# EAGLE schematic lt3477-buck-boost-flashlight-driver-17mm-mk-1.0 (EAGLE 9.2.0)
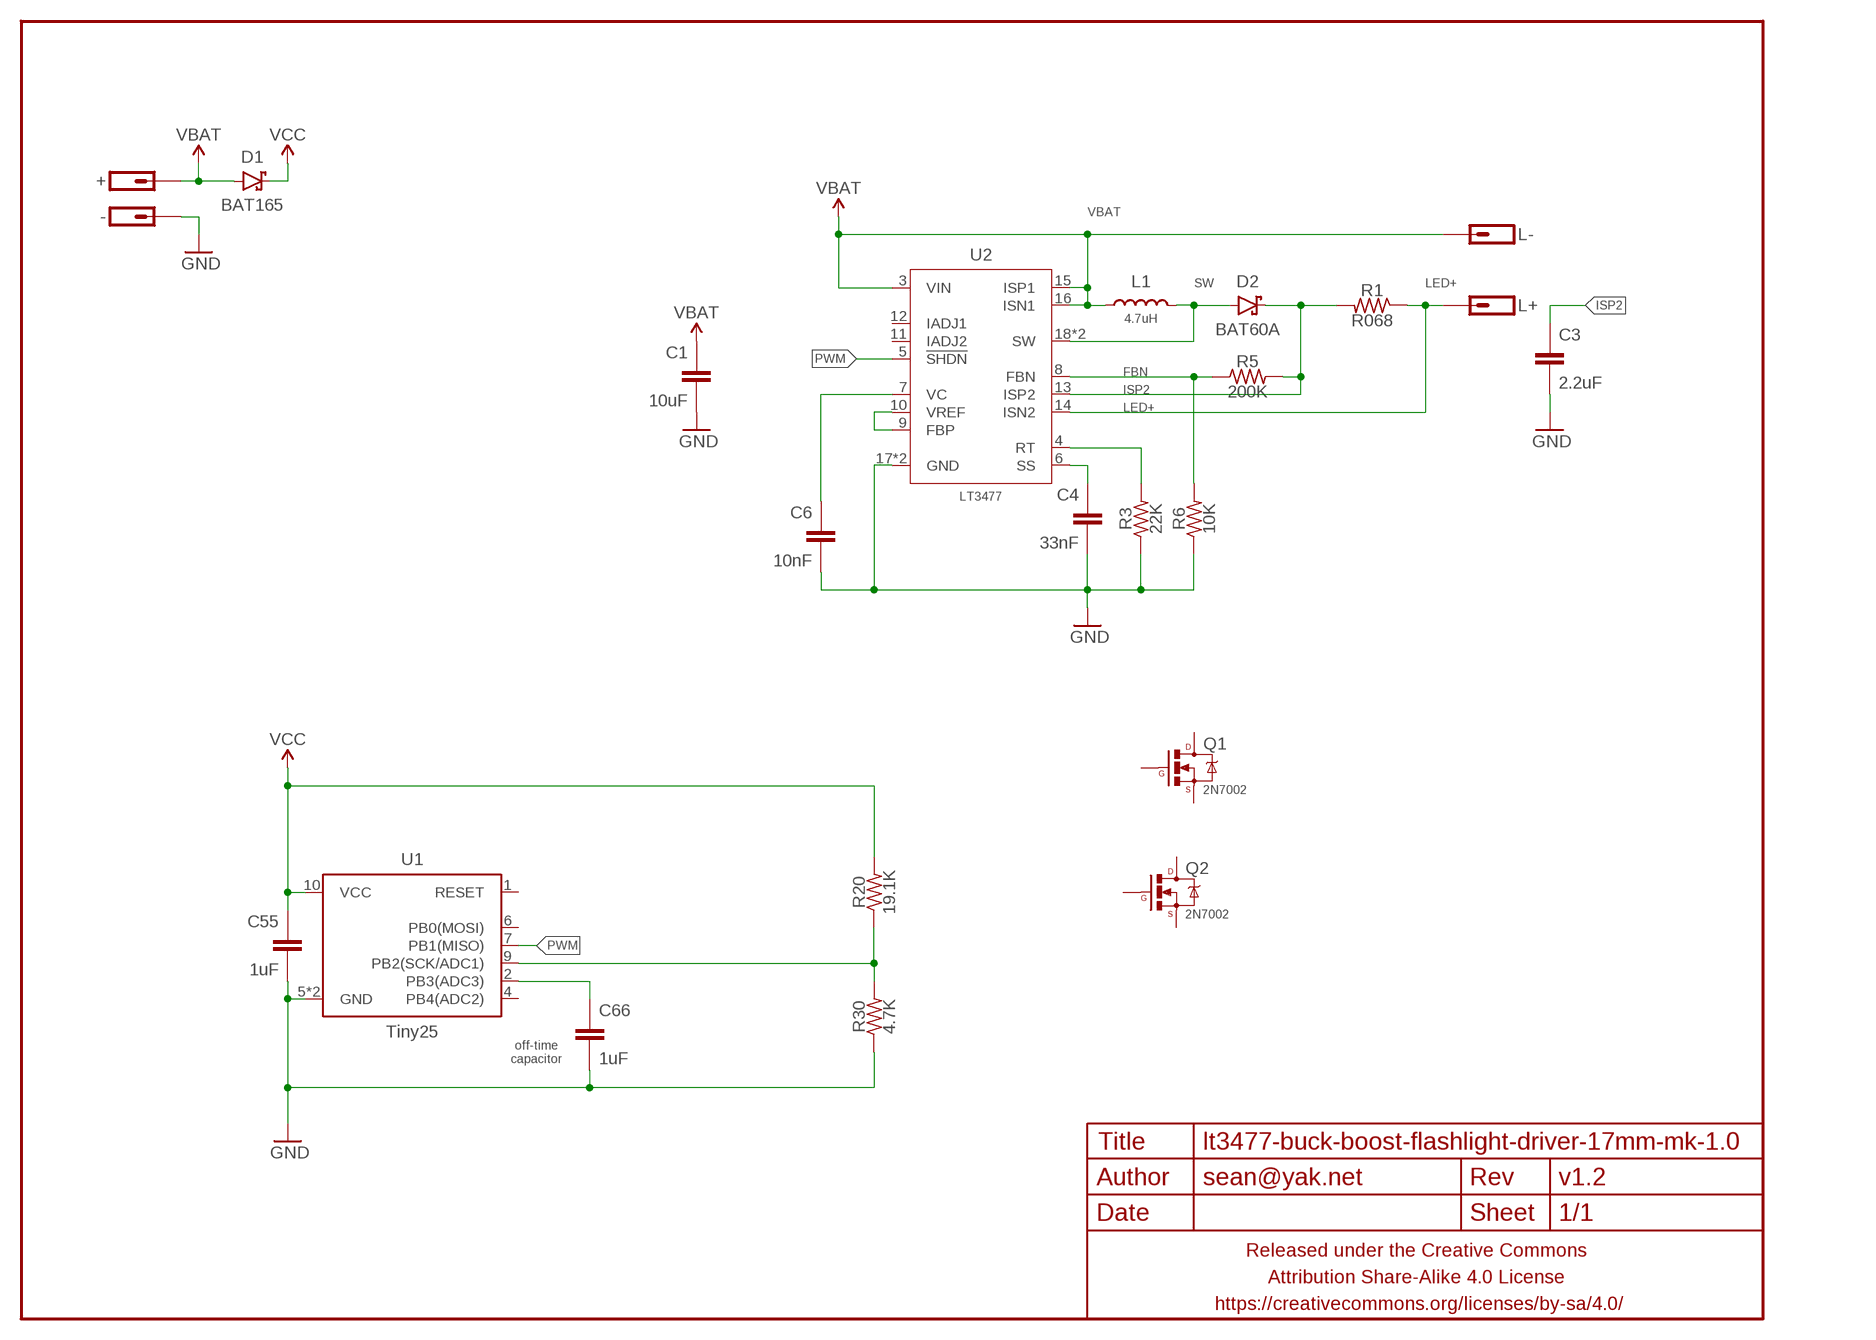
[diagram p0: schematic, sheet 1]

## Parts
+  M01PTH-1MM-CIR-NS  [1X01-1MM-CIR-NS]
-  M01NOT-A-VIA-NOPE  [1X01_NOSILK_NOSTOP]
C1  10uF  CAPACITOR-CERAMICC0603-TIGHTER  [C0603-TIGHTER]
C3  2.2uF  CAPACITOR-CERAMICC0603-TIGHTER  [C0603-TIGHTER]
C4  33nF  CAPACITOR-CERAMICC0402  [C0402]
C6  10nF  CAPACITOR-CERAMICC0402  [C0402]
C55  1uF  CAPACITOR-CERAMICC0603-TIGHTER  [C0603-TIGHTER]
C66  1uF  CAPACITOR-CERAMICC0402  [C0402]
D1  BAT165  DIODE-SCHOTTKYSOD323  [SOD323-SCHOTTKY]
D2  BAT60A  DIODE-SCHOTTKYSOD323  [SOD323-SCHOTTKY]
FRAME1  FRAME-LETTERNO_PACKAGE  [DUMMY]
L1  4.7uH  INDUCTORXAL40X0  [XAL40X0]
L+  M01PTH-1MM-CIR-NS  [1X01-1MM-CIR-NS]
L-  M01PTH-1MM-CIR-NS  [1X01-1MM-CIR-NS]
Q1  2N7002  MOSFET-NCHANNELIRLML2502  [SOT23]
Q2  2N7002  MOSFET-NCHANNELIRLML2502  [SOT23]
R1  R068  RESISTORR0805-TIGHTER  [R0805-TIGHTER]
R3  22K  RESISTORR0402  [R0402]
R5  200K  RESISTORR0402  [R0402]
R6  10K  RESISTORR0402  [R0402]
R20  19.1K  RESISTORR0603-TIGHTER  [R0603-TIGHTER]
R30  4.7K  RESISTORR0603-TIGHTER  [R0603-TIGHTER]
U1  Tiny25  ATTINY1310M1  [QFN10(2X5)]
U2  LT3477  [QFN20-LTC]

## Nets
FBN: R5.1 R6.2 U2.8(FBN)
GND: -.P$1 C1.2 C3.2 C4.2 C6.2 C55.2 C66.2 R3.1 R6.1 R30.1 U1.5(GND) U1.PAD(GND) U2.17(GND) U2.PAD(GND)
ISP2: C3.1 D2.C R1.2 R5.2 U2.13(ISP2)
LED+: L+.1 R1.1 U2.14(ISN2)
N$1: R3.2 U2.4(RT)
N$2: C6.1 U2.7(VC)
N$3: R20.1 R30.2 U1.9(PB2(SCK/ADC1))
N$4: C4.1 U2.6(SS)
N$5: C66.1 U1.2(PB3(ADC3))
N$9: U2.9(FBP) U2.10(VREF)
PWM: U1.7(PB1(MISO)) U2.5(!SHDN)
SW: D2.A L1.P$2 U2.18(SW) U2.19(SW)
VBAT: +.1 C1.1 D1.A L1.P$1 L-.1 U2.3(VIN) U2.15(ISP1) U2.16(ISN1)
VCC: C55.1 D1.C R20.2 U1.10(VCC)
Unconnected: Q1.1(G) Q1.2(S) Q1.3(D) Q2.1(G) Q2.2(S) Q2.3(D) U1.1(RESET) U1.4(PB4(ADC2)) U1.6(PB0(MOSI)) U2.11(IADJ2) U2.12(IADJ1)

## Notes on the sheet
- off-time
  capacitor

## Library data of the parts
+ - L+ L- = a_parts:M01: Header 1 Standard 1-pin 0.1" header. Use with straight break away headers (SKU : PRT-00116), right angle break away headers (PRT-00553), swiss pins (PRT-00743), machine pins (PRT-00117), and female headers (PRT-00115).
C1 C3 C4 C6 C55 C66 = a_parts:CAPACITOR-CERAMIC: CAPACITOR, European symbol
D1 D2 = a_parts:DIODE-SCHOTTKY: Schottky diodes in SFE's production catalog BAT20J 1A 23V 0.62Vf RB751 120mA 40V 0.37Vf PMEG4005EJ 0.5A 40V 0.42Vf MBRA140 1A 40V 0.5Vf B340A 3A 40V SMA
FRAME1 = a_parts:FRAME-LETTER: Schematic Frame Standard 8.5x11 US Letter frame; DESIGNER: sean@yak.net; VERSION: v1.2
L1 = a_parts:INDUCTOR: Inductors Basic Inductor/Choke - 0603 and 1206. Footprints are not proven and vary greatly between part numbers. SRN6045- 33uH, 20% 1.4A SDR0403-560KL - 56uH, 10%, 500mA RMS/740mA peak
Q1 Q2 = a_parts:MOSFET-NCHANNEL: Common NMOSFET Parts MFG P/N Store ID Prod ID FDD8780 TRANS-09984 SI7820DN TRANS-11055 FDS6630A IC-08089 2N7002PW TRANS-11151 FQP30N06L COM-10213 TRANS-10060 BSS123LT1G TRANS-08345 BSS138 TRANS-00830 BS170 2N7000
R1 R3 R5 R6 R20 R30 = a_parts:RESISTOR: RESISTOR, American symbol
U1 = a_parts:ATTINY13: Atmel 8-pin 1kB flash uC
U2 = a_parts:LT3477